# Altium schematic sheet ASE3-20.000MHz-K-T.SchDoc
size A; SheetNumber: 1; SheetTotal: 1
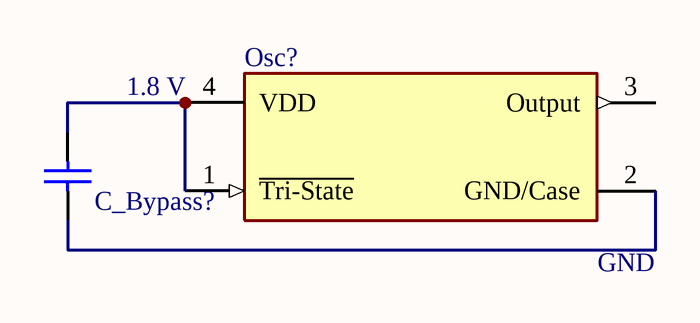
[diagram p0: ASE3-20.000MHz-K-T.SchDoc]

## Parts
C_Bypass?  VJ0603Y103KXAAP  [CAPC1608X92X38NL15T08]  (value not drawn)
Osc?  ASE3-20.000MHZ-KT  [FP-ASE3-MFG]  (value not drawn)

## Nets
NetC_Bypass?_1: C_Bypass?.1 Osc?.2(GND/Case)
NetC_Bypass?_2: C_Bypass?.2 Osc?.1(~{Tri-State}) Osc?.4(VDD)

Not connected (* = marked no-connect by the designer): Osc? 3(Output)

## Notes on the sheet
- 1.8 V
- (near Osc?) GND

## Library data of the parts
C_Bypass? = CMP-2006-01149-1: Manufacturer: Vitramon; Part Number: VJ0603Y103KXAAP
Osc? = CMP-27762-010045-1: XTAL OSC XO 20.0000MHZ CMOS SMD; Min Supply Voltage: 1.71V; Max Supply Current: 4mA; Operating Supply Voltage: 1.8V; Max Supply Voltage: 1.89V; Frequency: 20MHz; Frequency Stability: 30ppm; Load Capacitance: 15pF; Length: 3.2mm; Mount: Surface Mount; Min Operating Temperature: -10°C; Max Operating Temperature: 70°C; Series: ASE3; Height: 0.049inch; Package Quantity: 1000; Depth: 2.5mm; Case/Package: SMD/SMT; Number of Pins: 4; Lead Free: Lead Free; Width: 0.098inch; Termination: SMD/SMT; Packaging: Tape and Reel; Radiation Hardening: No